# Altium schematic sheet IO_board2.SchDoc
size 294 x 198 mm
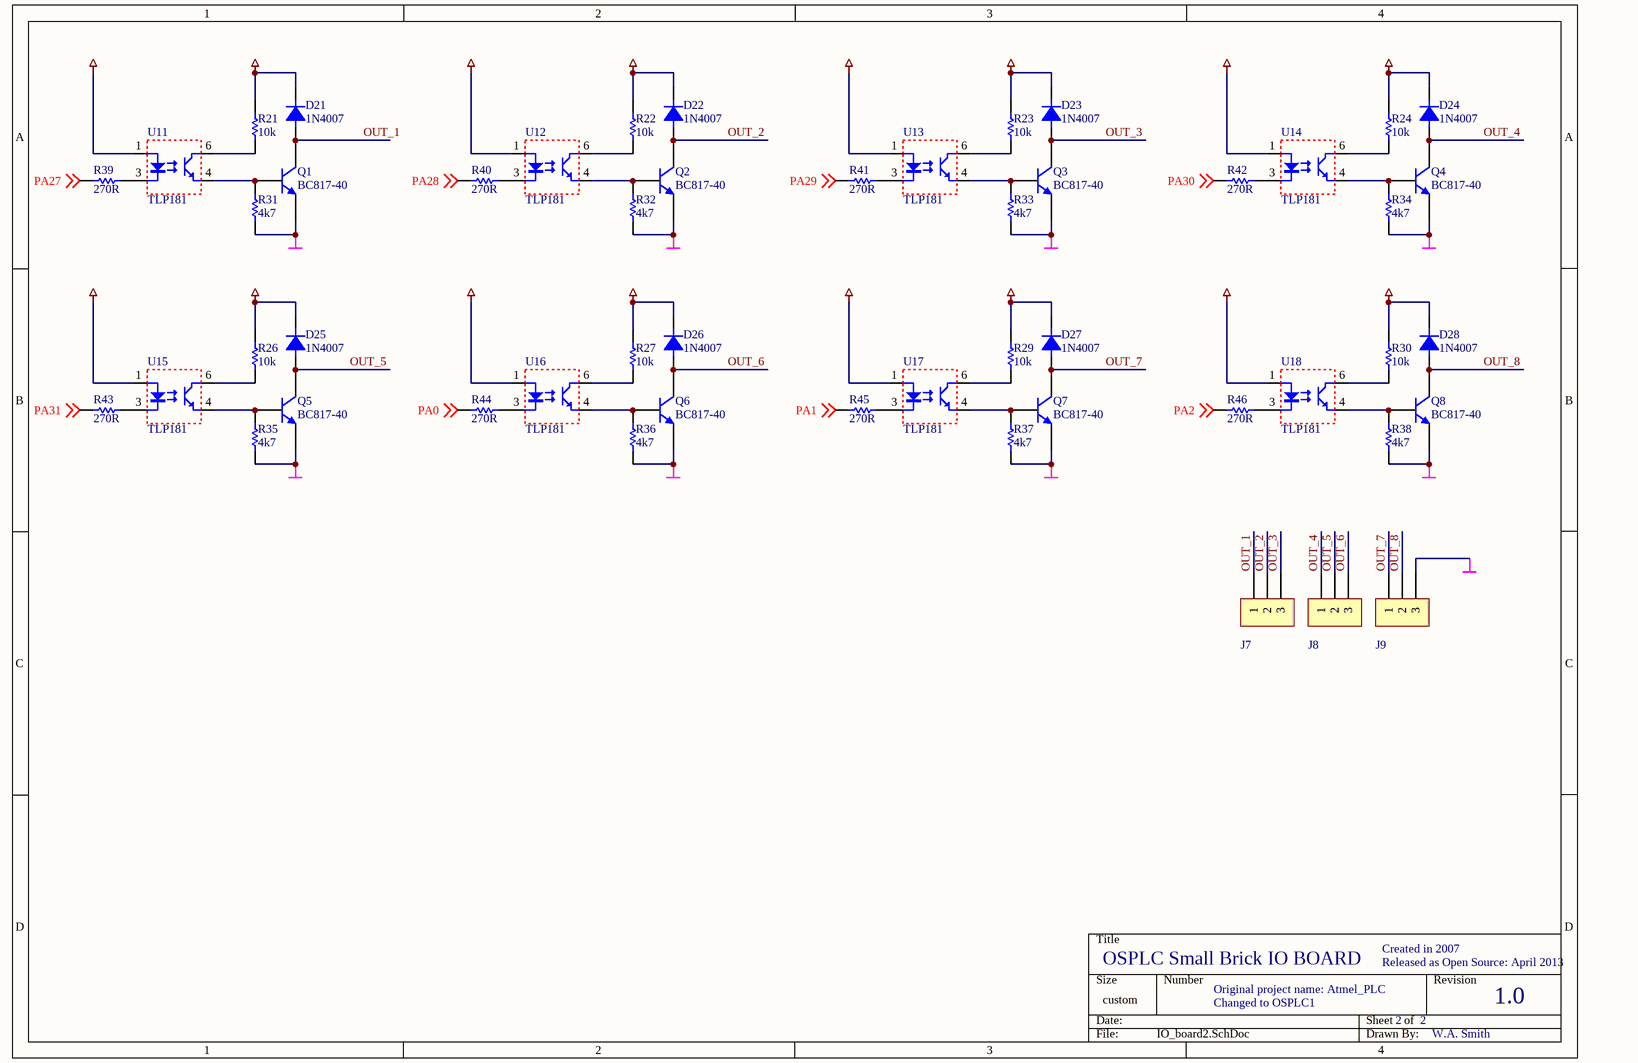
[diagram p0: IO_board2.SchDoc]

## Parts
D21  value 1N4007  [DIODE_RAD_3MM]  (hidden comment: 1N4007 Radialy Mounted)
D22  value 1N4007  [DIODE_RAD_3MM]  (hidden comment: 1N4007 Radialy Mounted)
D23  value 1N4007  [DIODE_RAD_3MM]  (hidden comment: 1N4007 Radialy Mounted)
D24  value 1N4007  [DIODE_RAD_3MM]  (hidden comment: 1N4007 Radialy Mounted)
D25  value 1N4007  [DIODE_RAD_3MM]  (hidden comment: 1N4007 Radialy Mounted)
D26  value 1N4007  [DIODE_RAD_3MM]  (hidden comment: 1N4007 Radialy Mounted)
D27  value 1N4007  [DIODE_RAD_3MM]  (hidden comment: 1N4007 Radialy Mounted)
D28  value 1N4007  [DIODE_RAD_3MM]  (hidden comment: 1N4007 Radialy Mounted)
J7  PCB TERMINAL  [TERMINAL_3WAY_5MM]  (value not drawn)
J8  PCB TERMINAL  [TERMINAL_3WAY_5MM]  (value not drawn)
J9  PCB TERMINAL  [TERMINAL_3WAY_5MM]  (value not drawn)
Q1  BC817-40  [SO-G3/Y1]
Q2  BC817-40  [SO-G3/Y1]
Q3  BC817-40  [SO-G3/Y1]
Q4  BC817-40  [SO-G3/Y1]
Q5  BC817-40  [SO-G3/Y1]
Q6  BC817-40  [SO-G3/Y1]
Q7  BC817-40  [SO-G3/Y1]
Q8  BC817-40  [SO-G3/Y1]
R21  value 10k  [0805]  (hidden comment: 0805)
R22  value 10k  [0805]  (hidden comment: 0805)
R23  value 10k  [0805]  (hidden comment: 0805)
R24  value 10k  [0805]  (hidden comment: 0805)
R26  value 10k  [0805]  (hidden comment: 0805)
R27  value 10k  [0805]  (hidden comment: 0805)
R29  value 10k  [0805]  (hidden comment: 0805)
R30  value 10k  [0805]  (hidden comment: 0805)
R31  value 4k7  [0805]  (hidden comment: 0805)
R32  value 4k7  [0805]  (hidden comment: 0805)
R33  value 4k7  [0805]  (hidden comment: 0805)
R34  value 4k7  [0805]  (hidden comment: 0805)
R35  value 4k7  [0805]  (hidden comment: 0805)
R36  value 4k7  [0805]  (hidden comment: 0805)
R37  value 4k7  [0805]  (hidden comment: 0805)
R38  value 4k7  [0805]  (hidden comment: 0805)
R39  value 270R  [0805]  (hidden comment: 0805)
R40  value 270R  [0805]  (hidden comment: 0805)
R41  value 270R  [0805]  (hidden comment: 0805)
R42  value 270R  [0805]  (hidden comment: 0805)
R43  value 270R  [0805]  (hidden comment: 0805)
R44  value 270R  [0805]  (hidden comment: 0805)
R45  value 270R  [0805]  (hidden comment: 0805)
R46  value 270R  [0805]  (hidden comment: 0805)
U11  TLP181  [SOP4_2.54]
U12  TLP181  [SOP4_2.54]
U13  TLP181  [SOP4_2.54]
U14  TLP181  [SOP4_2.54]
U15  TLP181  [SOP4_2.54]
U16  TLP181  [SOP4_2.54]
U17  TLP181  [SOP4_2.54]
U18  TLP181  [SOP4_2.54]

## Nets
OUT_GND: J9.3 Q1.2(E) Q2.2(E) Q3.2(E) Q4.2(E) Q5.2(E) Q6.2(E) Q7.2(E) Q8.2(E) R31.1 R32.1 R33.1 R34.1 R35.1 R36.1 R37.1 R38.1
VCC3v3: U11.1 U12.1 U13.1 U14.1 U15.1 U16.1 U17.1 U18.1
VCC24: D21.1(C) D22.1(C) D23.1(C) D24.1(C) D25.1(C) D26.1(C) D27.1(C) D28.1(C) R21.2 R22.2 R23.2 R24.2 R26.2 R27.2 R29.2 R30.2
OUT_1: D21.2(A) J7.1 Q1.3(C)
OUT_2: D22.2(A) J7.2 Q2.3(C)
OUT_3: D23.2(A) J7.3 Q3.3(C)
OUT_4: D24.2(A) J8.1 Q4.3(C)
OUT_5: D25.2(A) J8.2 Q5.3(C)
OUT_6: D26.2(A) J8.3 Q6.3(C)
OUT_7: D27.2(A) J9.1 Q7.3(C)
OUT_8: D28.2(A) J9.2 Q8.3(C)
PA0: R44.1 ; off-sheet PA0
PA1: R45.1 ; off-sheet PA1
PA2: R46.1 ; off-sheet PA2
PA27: R39.1 ; off-sheet PA27
PA28: R40.1 ; off-sheet PA28
PA29: R41.1 ; off-sheet PA29
PA30: R42.1 ; off-sheet PA30
PA31: R43.1 ; off-sheet PA31
NetQ1_1: Q1.1(B) R31.2 U11.4
NetQ2_1: Q2.1(B) R32.2 U12.4
NetQ3_1: Q3.1(B) R33.2 U13.4
NetQ4_1: Q4.1(B) R34.2 U14.4
NetQ5_1: Q5.1(B) R35.2 U15.4
NetQ6_1: Q6.1(B) R36.2 U16.4
NetQ7_1: Q7.1(B) R37.2 U17.4
NetQ8_1: Q8.1(B) R38.2 U18.4
NetR21_1: R21.1 U11.6
NetR22_1: R22.1 U12.6
NetR23_1: R23.1 U13.6
NetR24_1: R24.1 U14.6
NetR26_1: R26.1 U15.6
NetR27_1: R27.1 U16.6
NetR29_1: R29.1 U17.6
NetR30_1: R30.1 U18.6
NetR39_2: R39.2 U11.3
NetR40_2: R40.2 U12.3
NetR41_2: R41.2 U13.3
NetR42_2: R42.2 U14.3
NetR43_2: R43.2 U15.3
NetR44_2: R44.2 U16.3
NetR45_2: R45.2 U17.3
NetR46_2: R46.2 U18.3

## Notes on the sheet
- Created in 2007
- OSPLC Small Brick IO BOARD
- Original project name: Atmel_PLC
- Changed to OSPLC1
- Released as Open Source: April 2013
- 1.0
- 2
- W.A. Smith

## Library data of the parts
D21-D28 = 1N4007: 1N4007 Rectifier Diode Radialy Mounted
J7-J9 = TERMINAL_3WAY_5MM: 5mm spaced PCB terminal, 3 pole
Q1-Q8 = BC817-40: NPN General Purpose Amplifier; Manufacturer: Fairchild Semiconductor; Revision 1: 11-July-2000: SIM Model Added.; Revision 2: July-2002: Re-released for DXP Platform.; Package Information: Latest Revision: Sep-1998; Class I: Discrete; Class II: BJT - Low Power; Published: 8-Jun-2000; Datasheet: Latest Revision: 1997; Package Reference: SOT-23A; Publisher: Altium Limited
R21-R24 R26 R27 R29-R46 = RES_0805: 0805 footprint resistor
U11-U18 = TLP181: Toshiba Photocoupler